# EAGLE schematic steering_wheel_V2 (EAGLE 6.3)

## Sheet 1 of 6
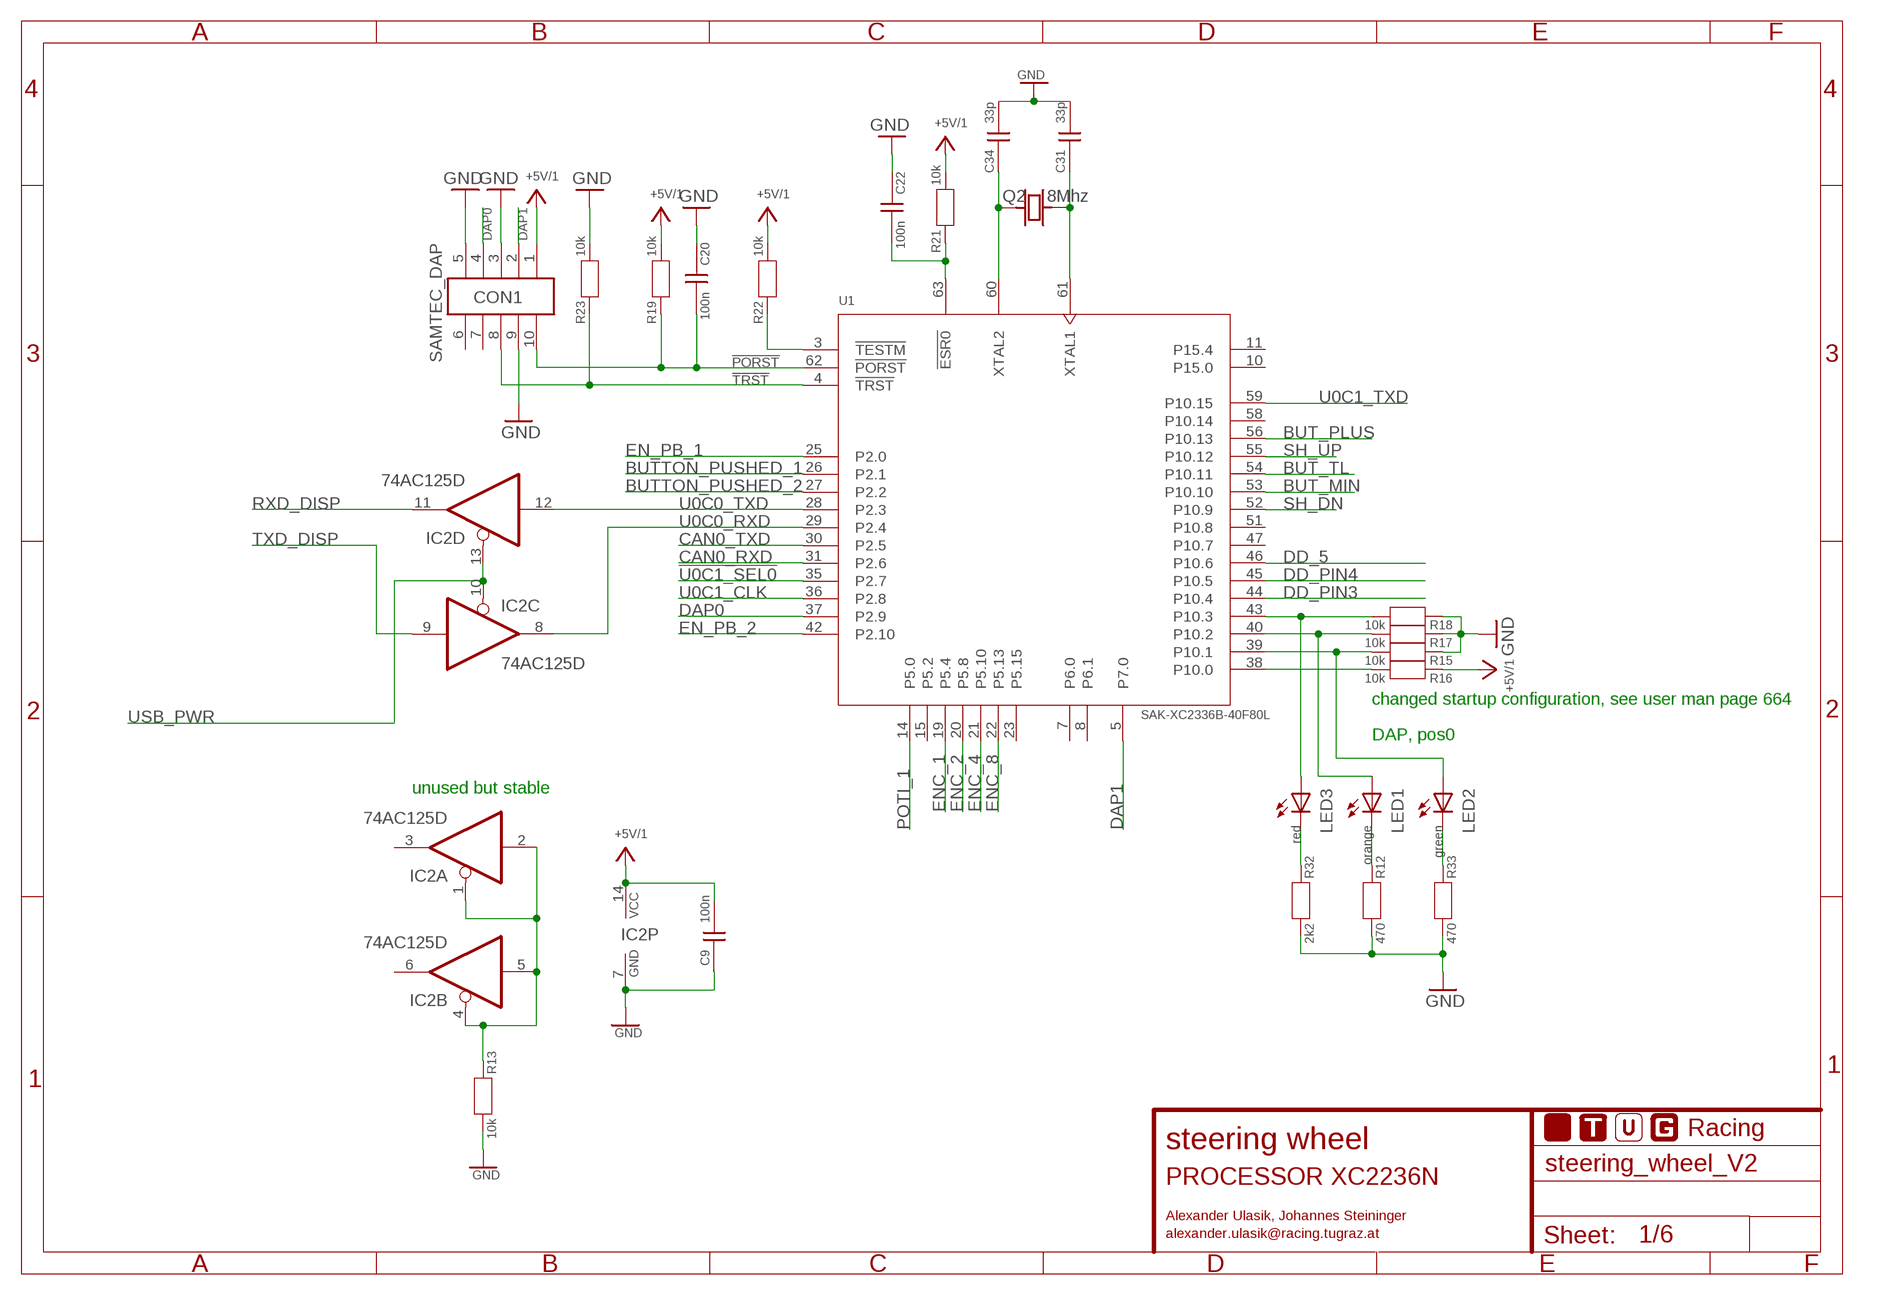
[diagram p0: schematic, sheet 1]

### Parts
C9  100n  C_1608M  [1608M_0603]
C20  100n  C_2012M  [2012M_0805]
C22  100n  C_2012M  [2012M_0805]
C31  33p  C_1608M  [1608M_0603]
C34  33p  C_1608M  [1608M_0603]
CON1  SAMTEC_DAP  [FTSH-105-01-XXX-DV-K]
FRAME1  A4L-LOC-RACING-NOLOGO  [NOLOGO]
IC2  74AC125D  [SO14]
LED1  LEDCHIPLED_0805  [CHIPLED_0805]
LED2  LEDCHIPLED_0805  [CHIPLED_0805]
LED3  LEDCHIPLED_0805  [CHIPLED_0805]
Q2  8Mhz  ABMM2  [ABMM2]
R12  470  R_2012M  [2012M_0805]
R13  10k  R_2012M  [2012M_0805]
R15  10k  R_2012M  [2012M_0805]
R16  10k  R_2012M  [2012M_0805]
R17  10k  R_2012M  [2012M_0805]
R18  10k  R_2012M  [2012M_0805]
R19  10k  R_2012M  [2012M_0805]
R21  10k  R_2012M  [2012M_0805]
R22  10k  R_2012M  [2012M_0805]
R23  10k  R_2012M  [2012M_0805]
R32  2k2  R_2012M  [2012M_0805]
R33  470  R_2012M  [2012M_0805]
U1  SAK-XC2336B-40F80L  [PG-LQFP-64-6]

### Nets
!PORST: C20.2 CON1.10 R19.1 U1.62(!PORST) ; also sheet 6
!TRST: CON1.8 R23.1 U1.4(!TRST) ; also sheet 6
!U0C1_SEL0: U1.35(P2.7) ; also sheet 4
+5V/1#: C9.2 CON1.1 IC2.14(P:VCC) R16.1 R19.2 R21.2 R22.2 ; supply symbol labelled +5V/1 ; also sheet 2,3,4,5,6
BUT_MIN: U1.53(P10.10) ; also sheet 6
BUT_PLUS: U1.56(P10.13) ; also sheet 6
BUT_TL: U1.54(P10.11) ; also sheet 6
BUTTON_PUSHED_1: U1.26(P2.1) ; also sheet 6
BUTTON_PUSHED_2: U1.27(P2.2) ; also sheet 6
CAN0_RXD: U1.31(P2.6) ; also sheet 5
CAN0_TXD: U1.30(P2.5) ; also sheet 5
DAP0: CON1.4 U1.37(P2.9) ; also sheet 6
DAP1: CON1.2 U1.5(P7.0) ; also sheet 6
DD_5: U1.46(P10.6) ; also sheet 6
DD_PIN3: U1.44(P10.4) ; also sheet 6
DD_PIN4: U1.45(P10.5) ; also sheet 6
EN_PB_1: U1.25(P2.0) ; also sheet 6
EN_PB_2: U1.42(P2.10) ; also sheet 6
ENC_1: U1.19(P5.4) ; also sheet 6
ENC_2: U1.20(P5.8) ; also sheet 6
ENC_4: U1.21(P5.10) ; also sheet 6
ENC_8: U1.22(P5.13) ; also sheet 6
GND: C9.1 C20.1 C22.1 C31.2 C34.2 CON1.3 CON1.5 CON1.9 IC2.7(P:GND) R12.2 R13.2 R15.1 R17.1 R18.1 R23.2 R32.2 R33.2 ; also sheet 2,3,4,5,6
N$1: C31.1 Q2.1 U1.61(XTAL1)
N$2: C34.1 Q2.3 U1.60(XTAL2)
N$4: R22.1 U1.3(!TESTM)
N$7: C22.2 R21.1 U1.63(!ESR0)
N$24: LED1.C R12.1
N$26: LED2.C R33.1
N$27: LED3.A R18.2 U1.43(P10.3)
N$28: IC2.1(A:OE) IC2.2(A:I) IC2.4(B:OE) IC2.5(B:I) R13.1
N$32: LED3.C R32.1
POTI_1: U1.14(P5.0) ; also sheet 6
RXD_DISP: IC2.11(D:O) ; also sheet 3,5
SH_DN: U1.52(P10.9) ; also sheet 6
SH_UP: U1.55(P10.12) ; also sheet 6
STATUS_0: R16.2 U1.38(P10.0)
STATUS_1: LED2.A R15.2 U1.39(P10.1)
STATUS_2: LED1.A R17.2 U1.40(P10.2)
TXD_DISP: IC2.9(C:I) ; also sheet 3,5
U0C0_RXD: IC2.8(C:O) U1.29(P2.4)
U0C0_TXD: IC2.12(D:I) U1.28(P2.3)
U0C1_CLK: U1.36(P2.8) ; also sheet 4
U0C1_TXD: U1.59(P10.15) ; also sheet 4
USB_PWR: IC2.10(C:OE) IC2.13(D:OE) ; also sheet 5
Unconnected: CON1.6 CON1.7 IC2.3(A:O) IC2.6(B:O) U1.7(P6.0) U1.8(P6.1) U1.10(P15.0) U1.11(P15.4) U1.15(P5.2) U1.23(P5.15) U1.47(P10.7) U1.51(P10.8) U1.58(P10.14)

### Notes on the sheet
- changed startup configuration, see user man page 664
- DAP, pos0
- unused but stable

## Sheet 2 of 6
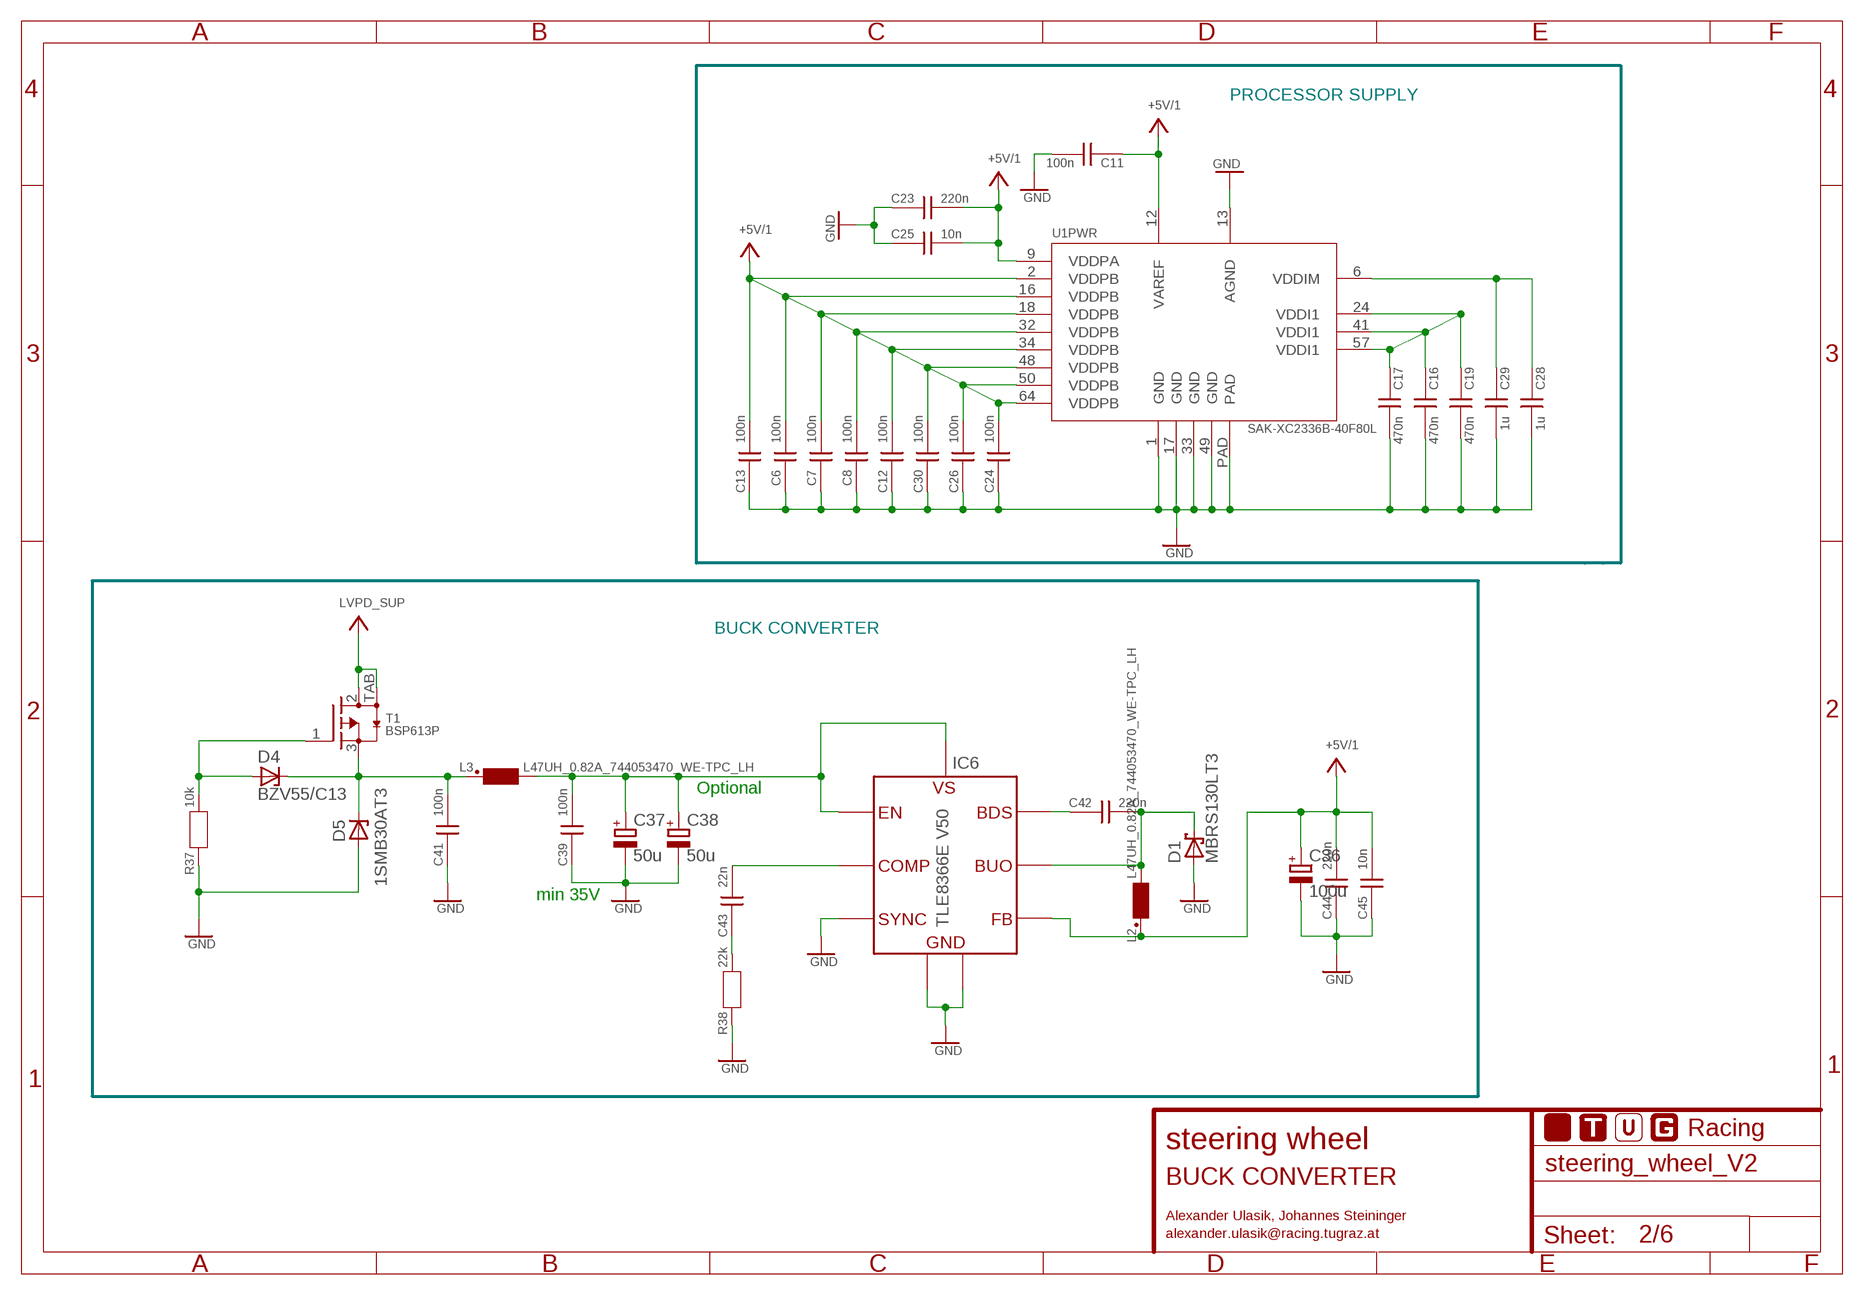
[diagram p1: schematic, sheet 2]

### Parts
C6  100n  C_2012M  [2012M_0805]
C7  100n  C_2012M  [2012M_0805]
C8  100n  C_2012M  [2012M_0805]
C11  100n  C_2012M  [2012M_0805]
C12  100n  C_2012M  [2012M_0805]
C13  100n  C_2012M  [2012M_0805]
C16  470n  C_2012M  [2012M_0805]
C17  470n  C_2012M  [2012M_0805]
C19  470n  C_2012M  [2012M_0805]
C23  220n  C_2012M  [2012M_0805]
C24  100n  C_2012M  [2012M_0805]
C25  10n  C_2012M  [2012M_0805]
C26  100n  C_2012M  [2012M_0805]
C28  1u  C_2012M  [2012M_0805]
C29  1u  C_2012M  [2012M_0805]
C30  100n  C_2012M  [2012M_0805]
C36  100u  CPOL-EUE5-10.5  [E5-10,5]
C37  50u  CPOL-EUE5-10.5  [E5-10,5]
C38  50u  CPOL-EUE5-10.5  [E5-10,5]
C39  100n  C_2012M  [2012M_0805]
C41  100n  C_2012M  [2012M_0805]
C42  220n  C_2012M  [2012M_0805]
C43  22n  C_2012M  [2012M_0805]
C44  220n  C_2012M  [2012M_0805]
C45  10n  C_2012M  [2012M_0805]
D1  MBRS130LT3  [SMB]
D4  BZV55/C13  ZENER-DIODESOD80C  [SOD80C]
D5  1SMB30AT3  ZENER-DIODESMB  [SMB]
FRAME4  A4L-LOC-RACING-BRD-TPLACE  [LOGO_RACING_BRD_TPLACE]
IC6  TLE8366E V50  TLE8366-II  [SOIC08-II]
L2  L47UH_0.82A_744053470_WE-TPC_LH  [WE-TPC_LH]
L3  L47UH_0.82A_744053470_WE-TPC_LH  [WE-TPC_LH]
R37  10k  R_2012M  [2012M_0805]
R38  22k  R_2012M  [2012M_0805]
T1  BSP613P  [SOT223-3]

### Nets
+5V/1#: C6.2 C7.2 C8.2 C11.1 C12.2 C13.2 C23.2 C24.2 C25.2 C26.2 C30.2 C36.+ C44.2 C45.2 IC6.4(FB) L2.1 U1.2(VDDPB) U1.9(VDDPA) U1.12(VAREF) U1.16(VDDPB) U1.18(VDDPB) U1.32(VDDPB) U1.34(VDDPB) U1.48(VDDPB) U1.50(VDDPB) U1.64(VDDPB) ; supply symbol labelled +5V/1 ; also sheet 1,3,4,5,6
GND: C6.1 C7.1 C8.1 C11.2 C12.1 C13.1 C16.2 C17.2 C19.2 C23.1 C24.1 C25.1 C26.1 C28.2 C29.2 C30.1 C36.- C37.- C38.- C39.1 C41.1 C44.1 C45.1 D1.A D5.A IC6.1(SYNC) IC6.2(GND1) IC6.HS(GND2) R37.1 R38.1 U1.1(GND) U1.13(AGND) U1.17(GND) U1.33(GND) U1.49(GND) U1.PAD ; also sheet 1,3,4,5,6
LVPD_SUP: T1.2(D) T1.TAB(D) ; also sheet 6
N$6: C16.1 C17.1 C19.1 U1.24(VDDI1) U1.41(VDDI1) U1.57(VDDI1)
N$9: C28.1 C29.1 U1.6(VDDIM)
N$23: C37.+ C38.+ C39.2 IC6.7(EN) IC6.8(VS) L3.2
N$30: C43.1 R38.2
N$34: D4.A R37.2 T1.1(G)
N$36: C43.2 IC6.3(COMP)
N$37: C42.2 D1.C IC6.6(BUO) L2.2
N$38: C42.1 IC6.5(BDS)
SUP6.1: C41.2 D4.C D5.C L3.1 T1.3(S)

### Notes on the sheet
- PROCESSOR SUPPLY
- BUCK CONVERTER
- Optional
- min 35V

## Sheet 3 of 6
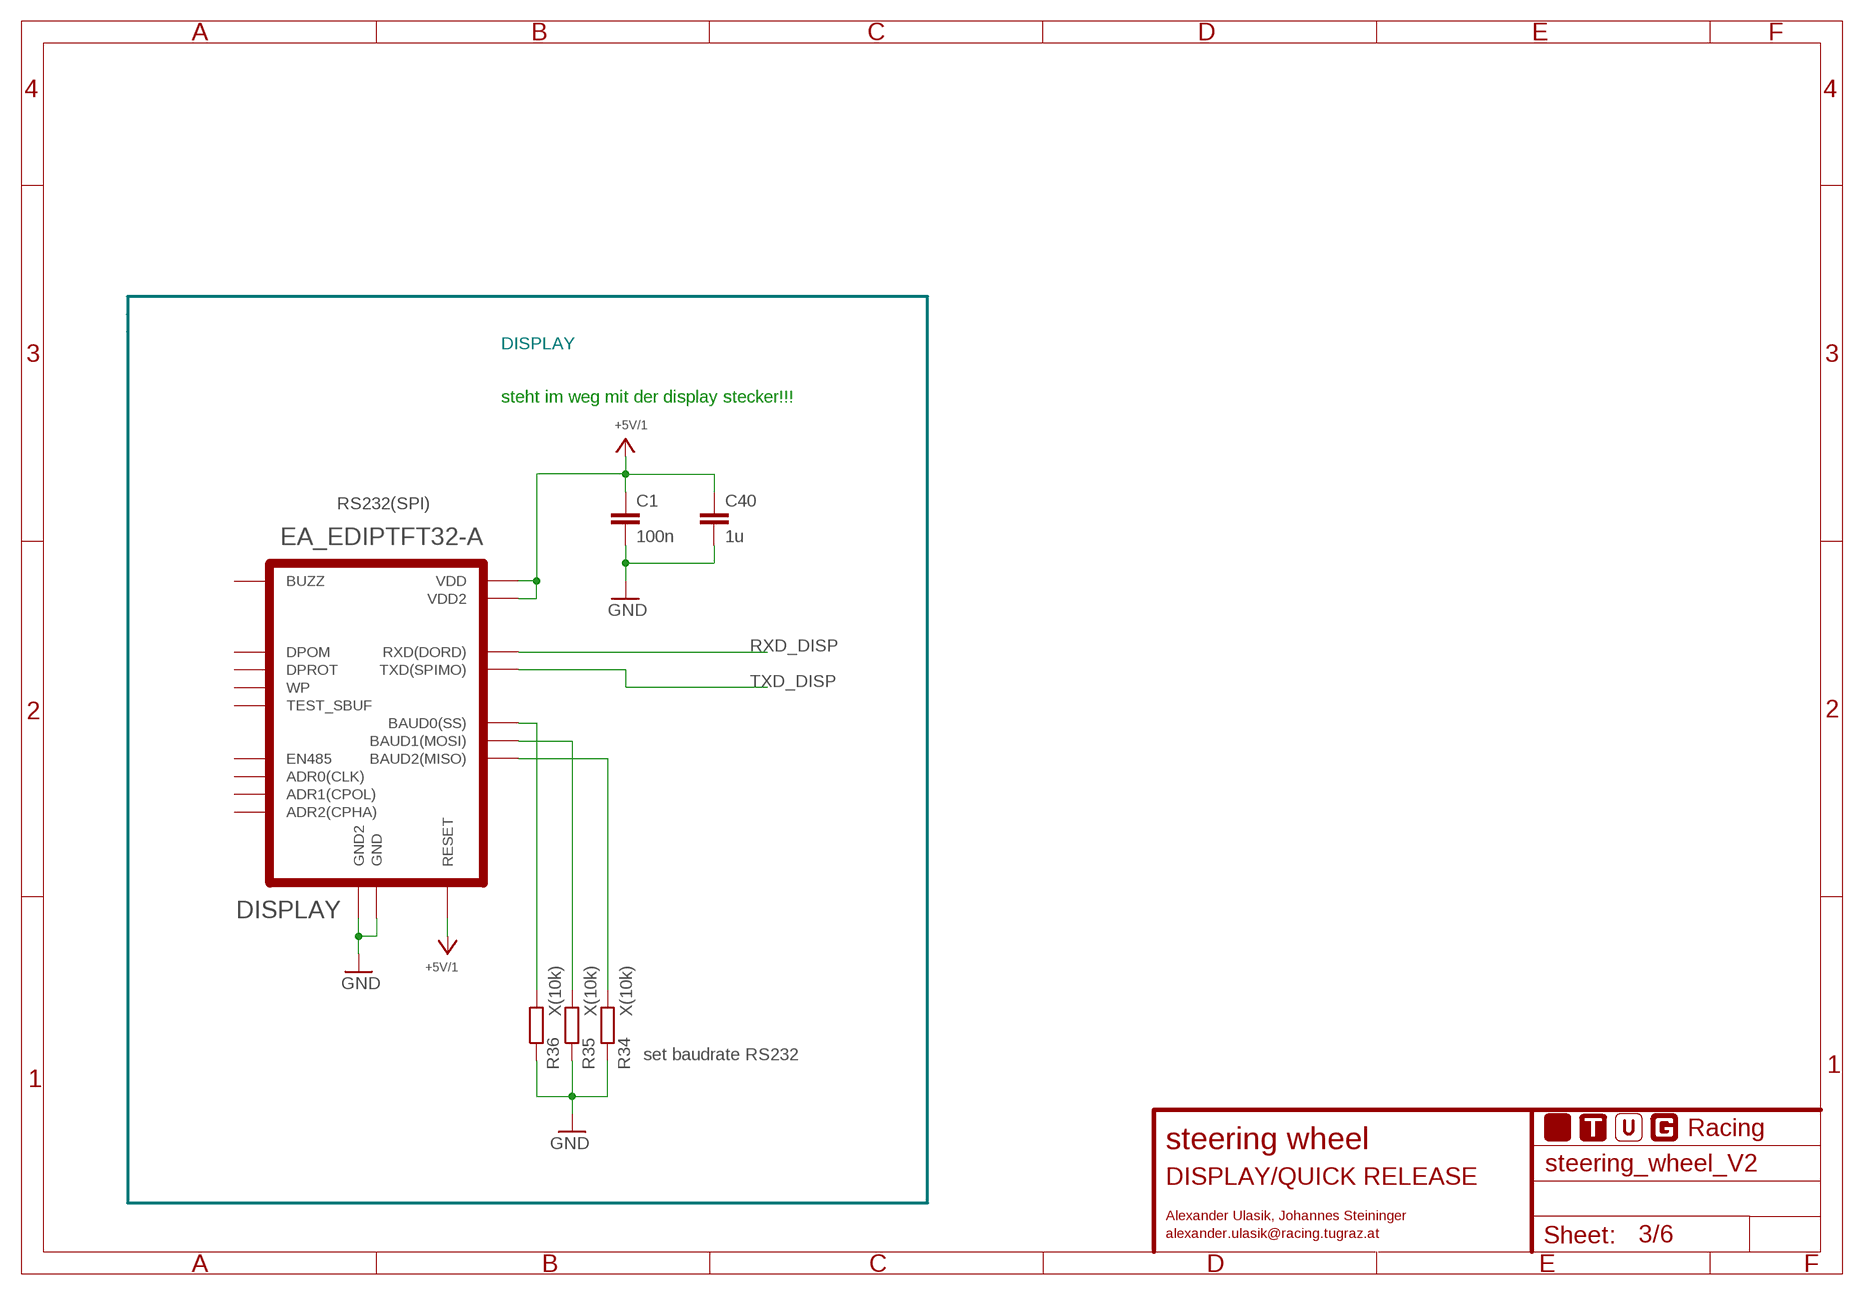
[diagram p2: schematic, sheet 3]

### Parts
C1  100n  C-EUC0805  [C0805]
C40  1u  C-EUC0805  [C0805]
DISPLAY  EA_EDIPTFT32-A  EA_EDIPTFT32-A-SR232  [EDIPTFT32-A]
FRAME3  A4L-LOC-RACING-NOLOGO  [NOLOGO]
R34  X(10k)  R-EU_R0805  [R0805]
R35  X(10k)  R-EU_R0805  [R0805]
R36  X(10k)  R-EU_R0805  [R0805]

### Nets
+5V/1#: C1.1 C40.1 DISPLAY.P$2(VDD) DISPLAY.P$5(RESET) DISPLAY.P$22(VDD2) ; supply symbol labelled +5V/1 ; also sheet 1,2,4,5,6
GND: C1.2 C40.2 DISPLAY.P$1(GND) DISPLAY.P$21(GND2) R34.1 R35.1 R36.1 ; also sheet 1,2,4,5,6
N$8: DISPLAY.P$8(BAUD2(MISO)) R34.2
N$10: DISPLAY.P$7(BAUD1(MOSI)) R35.2
N$13: DISPLAY.P$6(BAUD0(SS)) R36.2
RXD_DISP: DISPLAY.P$10(RXD(DORD)) ; also sheet 1,5
TXD_DISP: DISPLAY.P$11(TXD(SPIMO)) ; also sheet 1,5
Unconnected: DISPLAY.P$9(ADR0(CLK)) DISPLAY.P$12(EN485) DISPLAY.P$13(DPOM) DISPLAY.P$14(ADR1(CPOL)) DISPLAY.P$15(ADR2(CPHA)) DISPLAY.P$16(BUZZ) DISPLAY.P$17(DPROT) DISPLAY.P$19(WP) DISPLAY.P$20(TEST_SBUF)

### Notes on the sheet
- DISPLAY
- steht im weg mit der display stecker!!!
- set baudrate RS232

## Sheet 4 of 6
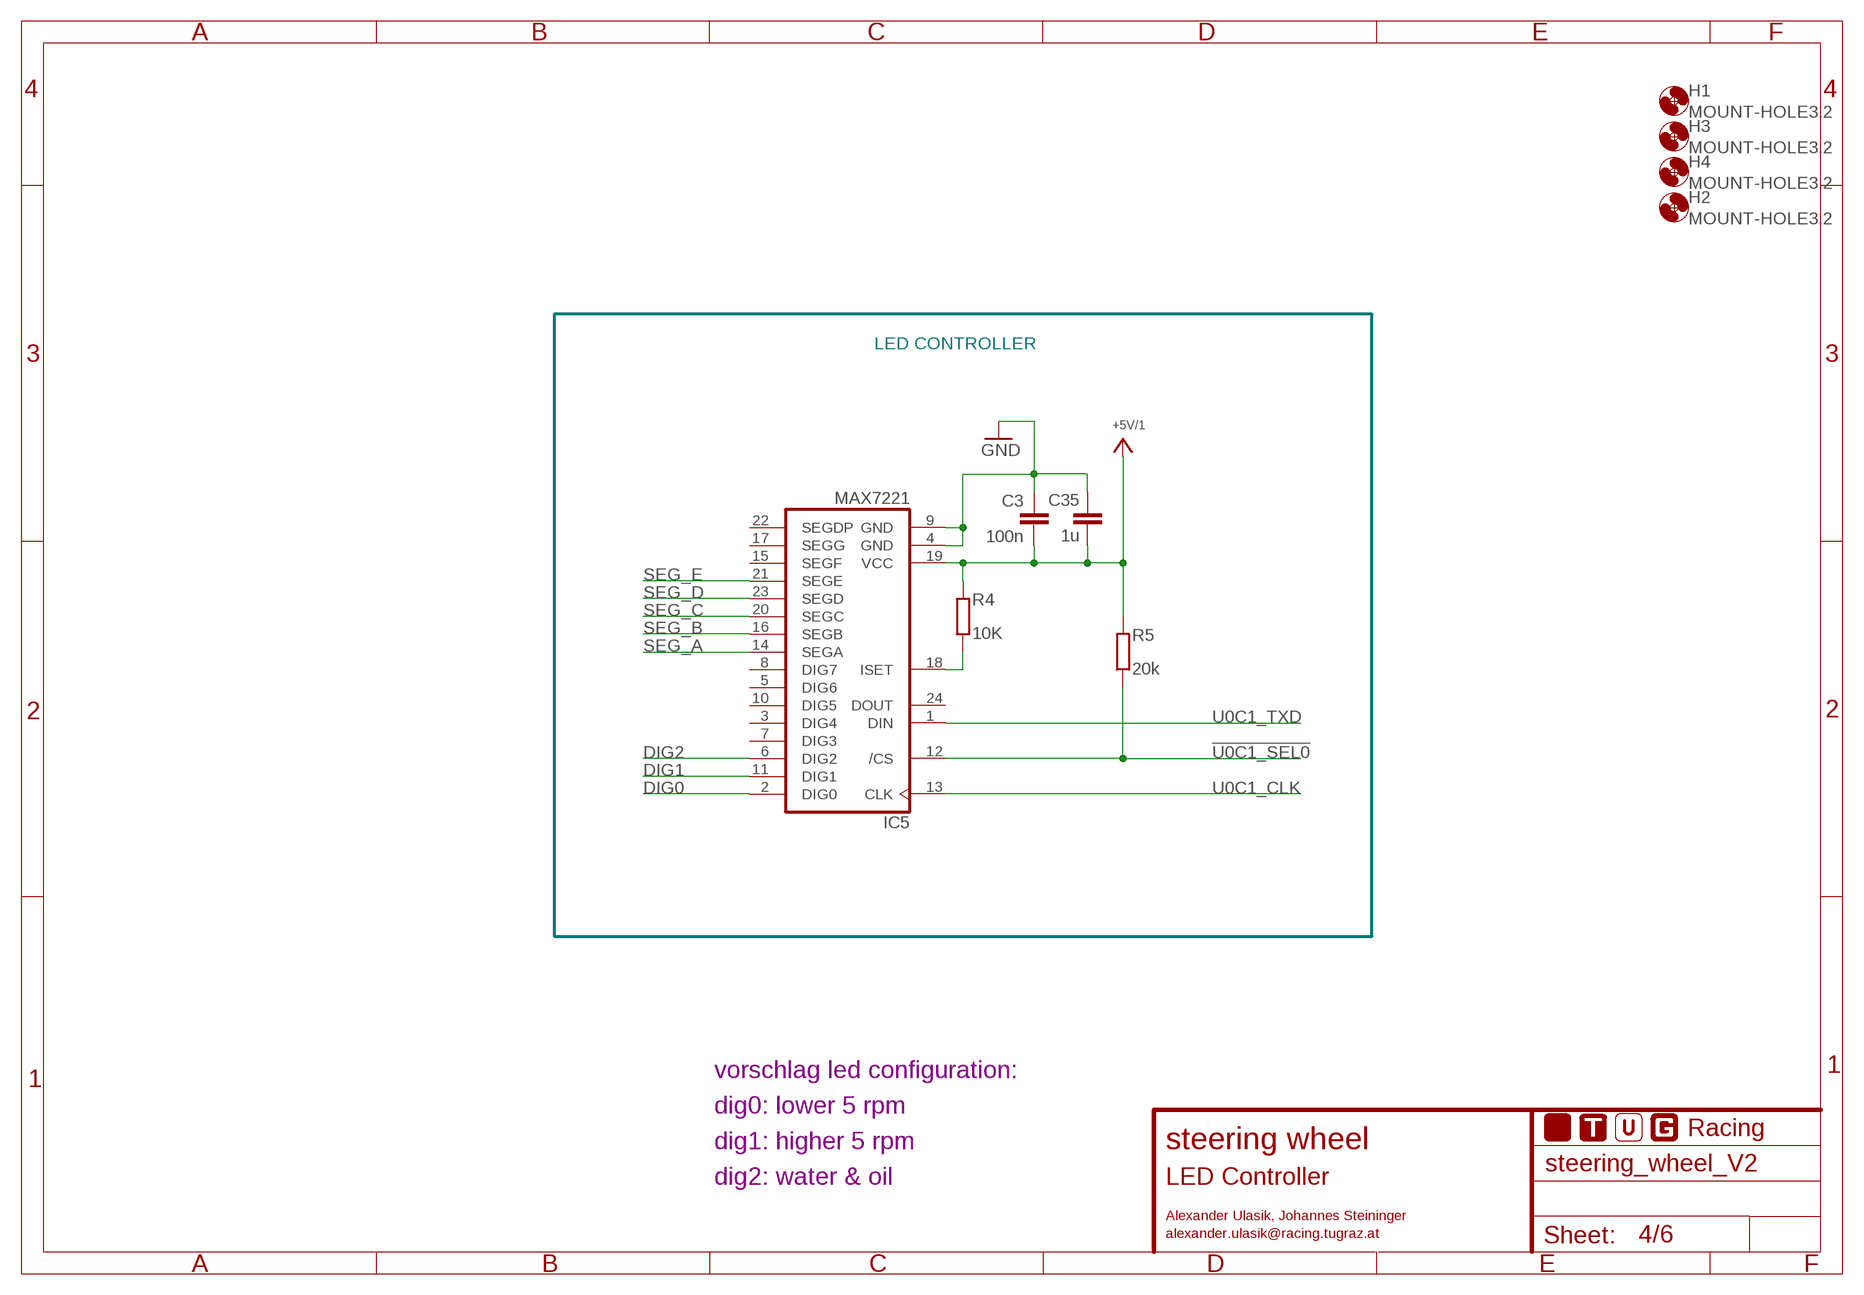
[diagram p3: schematic, sheet 4]

### Parts
C3  100n  C-EUC0805  [C0805]
C35  1u  C-EUC0805  [C0805]
FRAME5  A4L-LOC-RACING-NOLOGO  [NOLOGO]
H1  MOUNT-HOLE3.2  [3,2]
H2  MOUNT-HOLE3.2  [3,2]
H3  MOUNT-HOLE3.2  [3,2]
H4  MOUNT-HOLE3.2  [3,2]
IC5  MAX7221  [SO_W24]
R4  10K  R-EU_M0805  [M0805]
R5  20k  R-EU_M0805  [M0805]

### Nets
!U0C1_SEL0: IC5.12(/CS) R5.1 ; also sheet 1
+5V/1#: C3.1 C35.1 IC5.19(VCC) R4.1 R5.2 ; supply symbol labelled +5V/1 ; also sheet 1,2,3,5,6
DIG0: IC5.2(DIG0) ; also sheet 6
DIG1: IC5.11(DIG1) ; also sheet 6
DIG2: IC5.6(DIG2) ; also sheet 6
GND: C3.2 C35.2 IC5.4(GND) IC5.9(GND) ; also sheet 1,2,3,5,6
N$25: IC5.18(ISET) R4.2
SEG_A: IC5.14(SEGA) ; also sheet 6
SEG_B: IC5.16(SEGB) ; also sheet 6
SEG_C: IC5.20(SEGC) ; also sheet 6
SEG_D: IC5.23(SEGD) ; also sheet 6
SEG_E: IC5.21(SEGE) ; also sheet 6
U0C1_CLK: IC5.13(CLK) ; also sheet 1
U0C1_TXD: IC5.1(DIN) ; also sheet 1
Unconnected: IC5.3(DIG4) IC5.5(DIG6) IC5.7(DIG3) IC5.8(DIG7) IC5.10(DIG5) IC5.15(SEGF) IC5.17(SEGG) IC5.22(SEGDP) IC5.24(DOUT)

### Notes on the sheet
- LED CONTROLLER
- vorschlag led configuration:
- dig0: lower 5 rpm
- dig1: higher 5 rpm
- dig2: water & oil

## Sheet 5 of 6
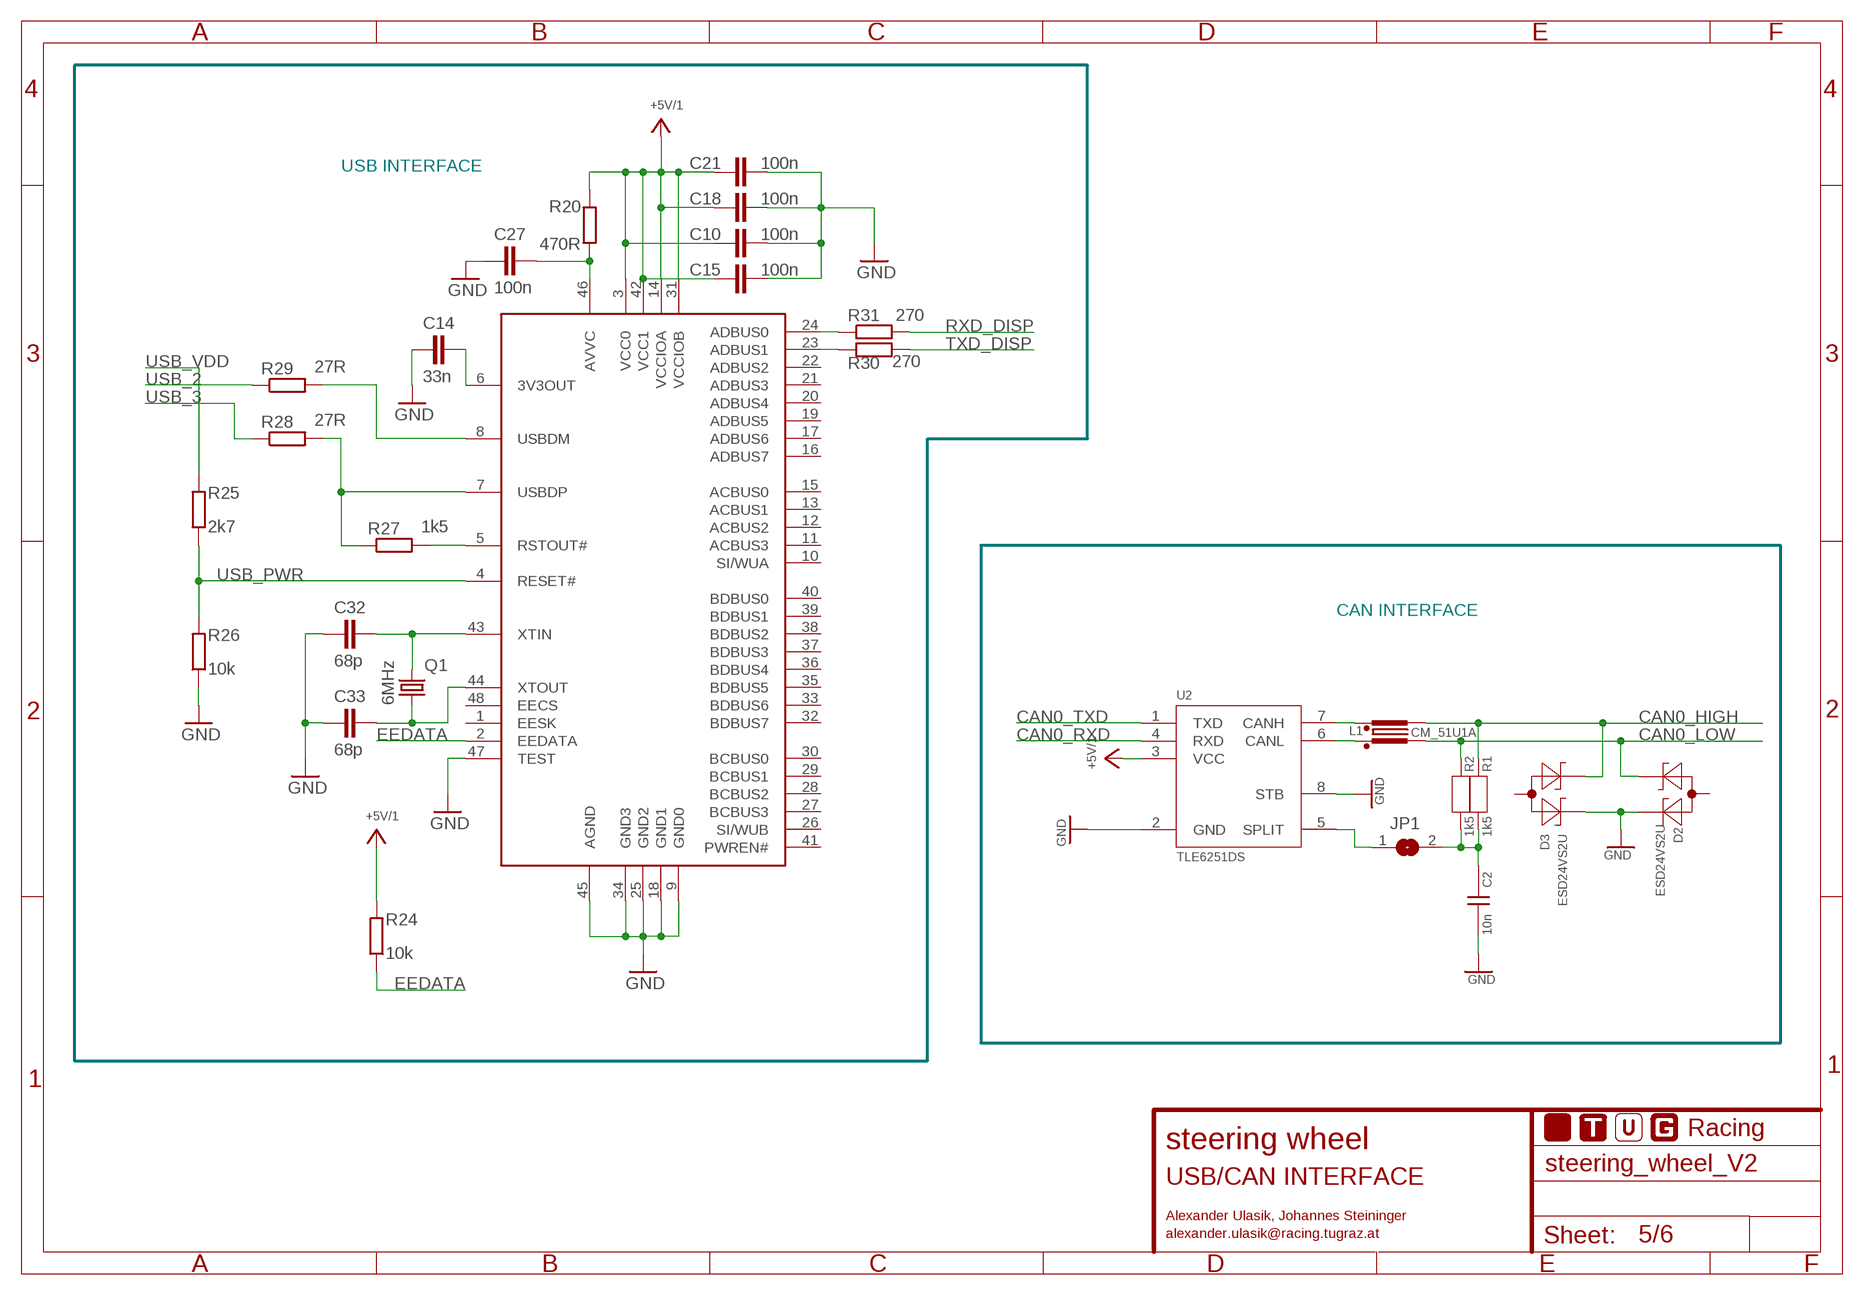
[diagram p4: schematic, sheet 5]

### Parts
C2  10n  C_2012M  [2012M_0805]
C10  100n  C-EUC0805  [C0805]
C14  33n  C-EUC0805  [C0805]
C15  100n  C-EUC0805  [C0805]
C18  100n  C-EUC0805  [C0805]
C21  100n  C-EUC0805  [C0805]
C27  100n  C-EUC0805  [C0805]
C32  68p  C-EUC0805  [C0805]
C33  68p  C-EUC0805  [C0805]
D2  ESD24VS2U  [SOT23-3]
D3  ESD24VS2U  [SOT23-3]
FRAME6  A4L-LOC-RACING-BRD-TPLACE  [LOGO_RACING_BRD_TPLACE]
IC1  FT2232  FT2232L  [LQFP48]
JP1  SJ  [SJ]
L1  CM_51U1A  [WE-SL2]
Q1  6MHz  CRYSTALHC49U70  [HC49U70]
R1  1k5  R_2012M  [2012M_0805]
R2  1k5  R_2012M  [2012M_0805]
R20  470R  R-EU_R0805  [R0805]
R24  10k  R-EU_R0805  [R0805]
R25  2k7  R-EU_R0805  [R0805]
R26  10k  R-EU_R0805  [R0805]
R27  1k5  R-EU_R0805  [R0805]
R28  27R  R-EU_R0805  [R0805]
R29  27R  R-EU_R0805  [R0805]
R30  270  R-EU_R0805  [R0805]
R31  270  R-EU_R0805  [R0805]
U2  TLE6251DS  [SO8]

### Nets
+5V/1#: C10.1 C15.1 C18.1 C21.1 IC1.3(VCC0) IC1.14(VCCIOA) IC1.31(VCCIOB) IC1.42(VCC1) R20.2 R24.2 U2.3(VCC) ; supply symbol labelled +5V/1 ; also sheet 1,2,3,4,6
CAN0_HIGH: D3.1(C1) L1.3 R1.1 ; also sheet 6
CAN0_LOW: D2.2(C2) L1.2 R2.1 ; also sheet 6
CAN0_RXD: U2.4(RXD) ; also sheet 1
CAN0_TXD: U2.1(TXD) ; also sheet 1
EEDATA: IC1.2(EEDATA) R24.1
GND: C2.2 C10.2 C14.1 C15.2 C18.2 C21.2 C27.1 C32.1 C33.1 D2.1(C1) D3.2(C2) IC1.9(GND0) IC1.18(GND1) IC1.25(GND2) IC1.34(GND3) IC1.45(AGND) IC1.47(TEST) R26.1 U2.2(GND) U2.8(STB) ; also sheet 1,2,3,4,6
N$3: C14.2 IC1.6(3V3OUT)
N$11: IC1.8(USBDM) R29.2
N$12: IC1.7(USBDP) R27.1 R28.2
N$14: IC1.5(RSTOUT#) R27.2
N$15: C27.2 IC1.46(AVVC) R20.1
N$16: L1.4 U2.7(CANH)
N$17: L1.1 U2.6(CANL)
N$18: IC1.24(ADBUS0) R31.1
N$19: IC1.23(ADBUS1) R30.1
N$20: C32.2 IC1.43(XTIN) Q1.2
N$21: C33.2 IC1.44(XTOUT) Q1.1
N$22: JP1.1 U2.5(SPLIT)
N$39: C2.1 JP1.2 R1.2 R2.2
RXD_DISP: R31.2 ; also sheet 1,3
TXD_DISP: R30.2 ; also sheet 1,3
USB_2: R29.1 ; also sheet 6
USB_3: R28.1 ; also sheet 6
USB_PWR: IC1.4(RESET#) R25.1 R26.2 ; also sheet 1
USB_VDD: R25.2 ; also sheet 6
Unconnected: D2.3(A) D3.3(A) IC1.1(EESK) IC1.10(SI/WUA) IC1.11(ACBUS3) IC1.12(ACBUS2) IC1.13(ACBUS1) IC1.15(ACBUS0) IC1.16(ADBUS7) IC1.17(ADBUS6) IC1.19(ADBUS5) IC1.20(ADBUS4) IC1.21(ADBUS3) IC1.22(ADBUS2) IC1.26(SI/WUB) IC1.27(BCBUS3) IC1.28(BCBUS2) IC1.29(BCBUS1) IC1.30(BCBUS0) IC1.32(BDBUS7) IC1.33(BDBUS6) IC1.35(BDBUS5) IC1.36(BDBUS4) IC1.37(BDBUS3) IC1.38(BDBUS2) IC1.39(BDBUS1) IC1.40(BDBUS0) IC1.41(PWREN#) IC1.48(EECS)

### Notes on the sheet
- USB INTERFACE
- CAN INTERFACE

## Sheet 6 of 6
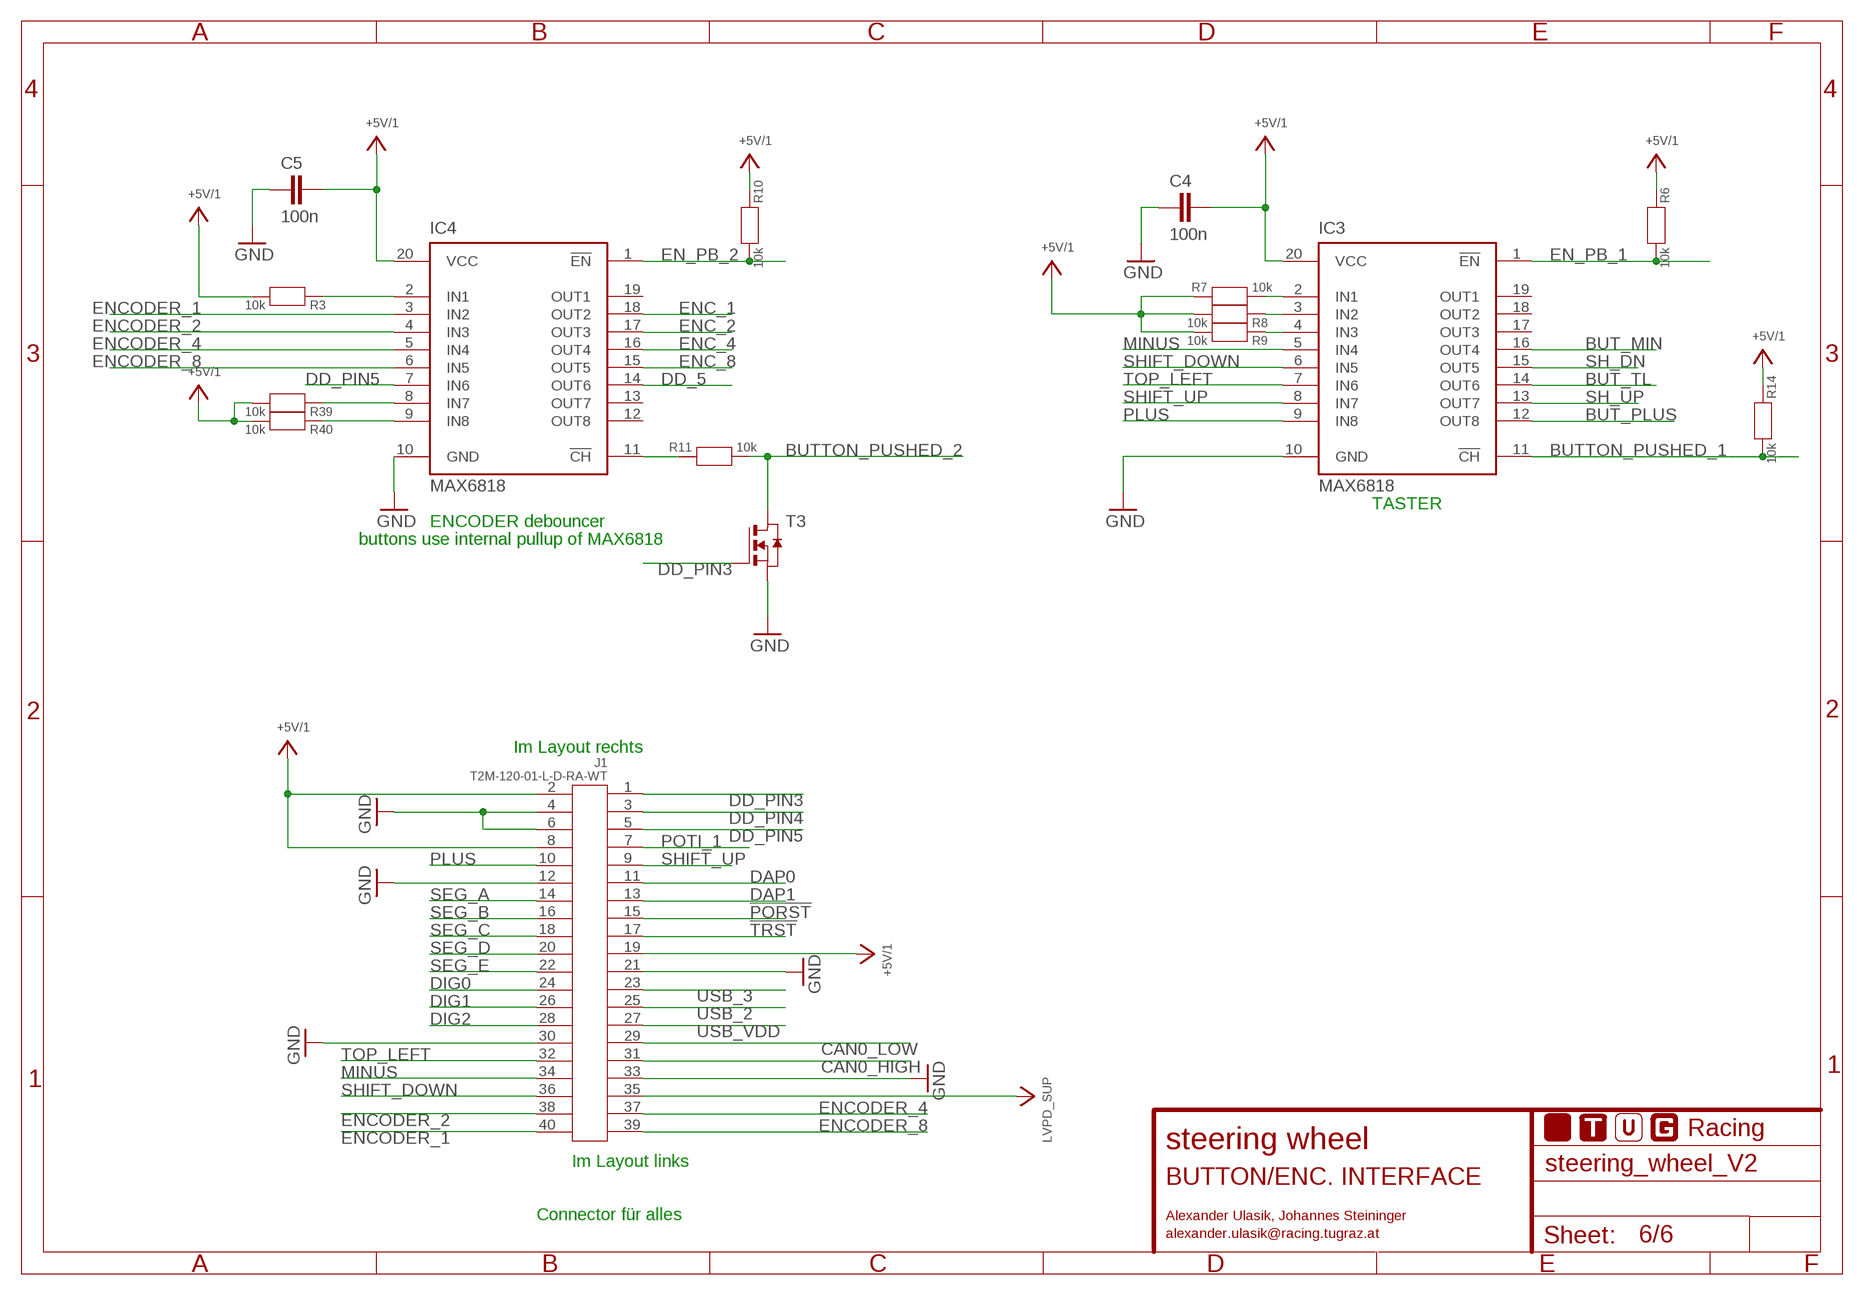
[diagram p5: schematic, sheet 6]

### Parts
C4  100n  C-EUC0805  [C0805]
C5  100n  C-EUC0805  [C0805]
FRAME2  A4L-LOC-RACING-NOLOGO  [NOLOGO]
IC3  MAX6818  [SSOP20]
IC4  MAX6818  [SSOP20]
J1  T2M-120-01-L-D-RA-WT  [T2M-120-01-L-D-RA-WT]
R3  10k  R_2012M  [2012M_0805]
R6  10k  R_2012M  [2012M_0805]
R7  10k  R_2012M  [2012M_0805]
R8  10k  R_2012M  [2012M_0805]
R9  10k  R_2012M  [2012M_0805]
R10  10k  R_2012M  [2012M_0805]
R11  10k  R_2012M  [2012M_0805]
R14  10k  R_2012M  [2012M_0805]
R39  10k  R_2012M  [2012M_0805]
R40  10k  R_2012M  [2012M_0805]
T3  NMOSSOT23  [SOT-23]

### Nets
!PORST: J1.15 ; also sheet 1
!TRST: J1.17 ; also sheet 1
+5V/1#: C4.2 C5.2 IC3.20(VCC) IC4.20(VCC) J1.2 J1.8 J1.19 R3.2 R6.1 R7.1 R8.2 R9.2 R10.1 R14.1 R39.2 R40.2 ; supply symbol labelled +5V/1 ; also sheet 1,2,3,4,5
BUT_MIN: IC3.16(OUT4) ; also sheet 1
BUT_PLUS: IC3.12(OUT8) ; also sheet 1
BUT_TL: IC3.14(OUT6) ; also sheet 1
BUTTON_PUSHED_1: IC3.11(!CH) R14.2 ; also sheet 1
BUTTON_PUSHED_2: R11.2 T3.1(D) ; also sheet 1
CAN0_HIGH: J1.31 ; also sheet 5
CAN0_LOW: J1.29 ; also sheet 5
DAP0: J1.11 ; also sheet 1
DAP1: J1.13 ; also sheet 1
DD_5: IC4.14(OUT6) ; also sheet 1
DD_PIN3: J1.1 T3.3(G) ; also sheet 1
DD_PIN4: J1.3 ; also sheet 1
DD_PIN5: IC4.7(IN6) J1.5
DIG0: J1.24 ; also sheet 4
DIG1: J1.26 ; also sheet 4
DIG2: J1.28 ; also sheet 4
EN_PB_1: IC3.1(!EN) R6.2 ; also sheet 1
EN_PB_2: IC4.1(!EN) R10.2 ; also sheet 1
ENC_1: IC4.18(OUT2) ; also sheet 1
ENC_2: IC4.17(OUT3) ; also sheet 1
ENC_4: IC4.16(OUT4) ; also sheet 1
ENC_8: IC4.15(OUT5) ; also sheet 1
ENCODER_1: IC4.3(IN2) J1.40
ENCODER_2: IC4.4(IN3) J1.38
ENCODER_4: IC4.5(IN4) J1.37
ENCODER_8: IC4.6(IN5) J1.39
GND: C4.1 C5.1 IC3.10(GND) IC4.10(GND) J1.4 J1.6 J1.12 J1.21 J1.30 J1.33 T3.2(S) ; also sheet 1,2,3,4,5
LVPD_SUP: J1.35 ; also sheet 2
MINUS: IC3.5(IN4) J1.34
N$5: IC4.8(IN7) R39.1
N$29: IC4.2(IN1) R3.1
N$31: IC4.9(IN8) R40.1
N$33: IC3.2(IN1) R7.2
N$35: IC4.11(!CH) R11.1
N$45: IC3.3(IN2) R8.1
N$46: IC3.4(IN3) R9.1
PLUS: IC3.9(IN8) J1.10
POTI_1: J1.7 ; also sheet 1
SEG_A: J1.14 ; also sheet 4
SEG_B: J1.16 ; also sheet 4
SEG_C: J1.18 ; also sheet 4
SEG_D: J1.20 ; also sheet 4
SEG_E: J1.22 ; also sheet 4
SH_DN: IC3.15(OUT5) ; also sheet 1
SH_UP: IC3.13(OUT7) ; also sheet 1
SHIFT_DOWN: IC3.6(IN5) J1.36
SHIFT_UP: IC3.8(IN7) J1.9
TOP_LEFT: IC3.7(IN6) J1.32
USB_2: J1.25 ; also sheet 5
USB_3: J1.23 ; also sheet 5
USB_VDD: J1.27 ; also sheet 5
Unconnected: IC3.17(OUT3) IC3.18(OUT2) IC3.19(OUT1) IC4.12(OUT8) IC4.13(OUT7) IC4.19(OUT1)

### Notes on the sheet
- TASTER
- ENCODER debouncer
- buttons use internal pullup of MAX6818
- Im Layout rechts
- Im Layout links
- Connector für alles

## Library data of the parts
C1 C3-C5 C10 C14 C15 C18 C21 C27 C32 C33 C35 C40 = rcl:C-EU: CAPACITOR, European symbol
C2 C6-C9 C11-C13 C16 C17 C19 C20 C22-C26 C28-C31 C34 C39 C41-C45 = C:C
C36-C38 = rcl:CPOL-EU: POLARIZED CAPACITOR, European symbol
CON1 = Samtec_E_Racing:SAMTEC_DAP
D1 = diode:MBRS130LT3: Schottky Power Rectifier Source: http://www.onsemi.com/pub/Collateral/MBRS130LT3-D.PDF
D2 D3 = D:ESD24VS2U: Silicon TVS diodes ESD24VS2U Features: ESD / transient protection of automotive CAN / LIN bus networks / transceivers, industrial bus systems and power supply lines according to: IEC61000-4-2 (ESD): ± 30 kV (air / contact) IEC61000-4-4 (EFT): 80 A (5/50 ns) IEC61000-4-5 (surge): 5 A (8/20 µs) ISO7637-2: Pulse 1 (max. 50 V), Pulse 2 (max. 125 V), Pulse 3a, b (max. 800 V) Max. working voltage: 24 V Low capacitance: 24 pF typ. Low clamping voltage: < 41 V Extremely low reverse current: < 1 nA typ. Pb-free (RoHS compliant) package Qualified according AEC Q101 Applications: Low and High-Speed CAN Fault Tolerant CAN Industrial control networks 12/24 V DC power supply lines
D4 = diode:ZENER-DIODE: Z-Diode
D5 = 1Adiode:ZENER-DIODE: Z-Diode
DISPLAY = _TUG Racing Team_:EA_EDIPTFT32-A-SR232
FRAME1 = frames:A4L-LOC-RACING: FRAME DIN A4, landscape with location and doc. field; FRAME_EMAIL: alexander.ulasik@racing.tugraz.at; FRAME_SUBTITLE: PROCESSOR XC2236N; FRAME_TITLE: steering wheel; FRAME_USER: Alexander Ulasik, Johannes Steininger
FRAME2 = frames:A4L-LOC-RACING: FRAME DIN A4, landscape with location and doc. field; FRAME_EMAIL: alexander.ulasik@racing.tugraz.at; FRAME_SUBTITLE: BUTTON/ENC. INTERFACE; FRAME_TITLE: steering wheel; FRAME_USER: Alexander Ulasik, Johannes Steininger
FRAME3 = frames:A4L-LOC-RACING: FRAME DIN A4, landscape with location and doc. field; FRAME_EMAIL: alexander.ulasik@racing.tugraz.at; FRAME_SUBTITLE: DISPLAY/QUICK RELEASE; FRAME_SUBTITLE_SUB: QUICK RELEASE; FRAME_TITLE: steering wheel; FRAME_USER: Alexander Ulasik, Johannes Steininger
FRAME4 = frames:A4L-LOC-RACING: FRAME DIN A4, landscape with location and doc. field; FRAME_EMAIL: alexander.ulasik@racing.tugraz.at; FRAME_SUBTITLE: BUCK CONVERTER; FRAME_TITLE: steering wheel; FRAME_USER: Alexander Ulasik, Johannes Steininger
FRAME5 = frames:A4L-LOC-RACING: FRAME DIN A4, landscape with location and doc. field; FRAME_EMAIL: alexander.ulasik@racing.tugraz.at; FRAME_SUBTITLE: LED Controller; FRAME_SUBTITLE_SUB: LED Controller; FRAME_TITLE: steering wheel; FRAME_USER: Alexander Ulasik, Johannes Steininger
FRAME6 = frames:A4L-LOC-RACING: FRAME DIN A4, landscape with location and doc. field; FRAME_EMAIL: alexander.ulasik@racing.tugraz.at; FRAME_SUBTITLE: USB/CAN INTERFACE; FRAME_TITLE: steering wheel; FRAME_USER: Alexander Ulasik, Johannes Steininger
H1-H4 = holes:MOUNT-HOLE: MOUNTING HOLE with drill center marker
IC1 = ftdichip:FT2232L: USB UART / FIFO Controller 3nd Generation USB Double-UART (USB <-> Serial) - FIFO Controller
IC2 = 74xx-eu:74*125: Quad bus BUFFER, 3-state
IC3 IC4 = misto:MAX6818: +-15kV ESD-Protected, Octal CMOS Switch Debouncers
IC5 = _TUG Racing Team_:MAX7221
IC6 = infineon:TLE8366
J1 = J:T2M-120-01-L-D-*: Samtec Tiger Eye 2mm Wire-to-Board Sockets Specifications Wire: 24, 26, 28 or 30 AWG Current Rating: 3.0A per pin
JP1 = jumper:SJ: SMD solder JUMPER
L1 = L:CM: Common Mode Line Filter Type Case L @ 1kHz [H] Z [Ohm] Inom [mA] Rdc [Ohm] Application Würth No. CM_67R400MA 0805 67 @ 100MHz 400 0.25 744231061 CM_90R370MA 0805 90 @ 100MHz 370 0.30 USB 2.0 744231091 CM_120R370MA 0805 120 @ 100MHz 370 0.30 IEEE1394/Firewire 400 Mbps 744231121 CM_180R330MA 0805 180 @ 100MHz 330 0.35 IEEE1394/Firewire 400 Mbps 744231181 CM_260R300MA 0805 260 @ 100MHz 300 0.40 744231261 CM_370R280MA 0805 370 @ 100MHz 280 0.45 IEEE1394/Firewire 400 Mbps 744231371 CM_51U1A WS-SL2 51µ max. 5000 1000 0.16 CAN 744227S
L2 L3 = L:L: Inductance SMD Inductances Power-Chokes: Wuerth Elektronik WE-PD Series Wuerth Elektronik WE-TPC Series Coiltronics DR Series Distributor: Farnell Austria - http://at.farnell.com/
LED1-LED3 = led:LED: LED OSRAM: - CHIPLED LG R971, LG N971, LY N971, LG Q971, LY Q971, LO R971, LY R971 LH N974, LH R974 LS Q976, LO Q976, LY Q976 LO Q996 - Hyper CHIPLED LW Q18S LB Q993, LB Q99A, LB R99A - SideLED LS A670, LO A670, LY A670, LG A670, LP A670 LB A673, LV A673, LT A673, LW A673 LH A674 LY A675 LS A676, LA A676, LO A676, LY A676, LW A676 LS A679, LY A679, LG A679 - Hyper Micro SIDELED® LS Y876, LA Y876, LO Y876, LY Y876 LT Y87S - SmartLED LW L88C, LW L88S LB L89C, LB L89S, LG L890 LS L89K, LO L89K, LY L89K LS L896, LA L896, LO L896, LY L896 - TOPLED LS T670, LO T670, LY T670, LG T670, LP T670 LSG T670, LSP T670, LSY T670, LOP T670, LYG T670 LG T671, LOG T671, LSG T671 LB T673, LV T673, LT T673, LW T673 LH T674 LS T676, LA T676, LO T676, LY T676, LB T676, LH T676, LSB T676, LW T676 LB T67C, LV T67C, LT T67C, LS T67K, LO T67K, LY T67K, LW E67C LS E67B, LA E67B, LO E67B, LY E67B, LB E67C, LV E67C, LT E67C LW T67C LS T679, LY T679, LG T679 LS T770, LO T770, LY T770, LG T770, LP T770 LB T773, LV T773, LT T773, LW T773 LH T774 LS E675, LA E675, LY E675, LS T675 LS T776, LA T776, LO T776, LY T776, LB T776 LHGB T686 LT T68C, LB T68C - Hyper Mini TOPLED® LB M676 - Mini TOPLED Santana® LG M470 LS M47K, LO M47K, LY M47K Source: http://www.osram.convergy.de LUXEON: - LUMILED® LXK2-PW12-R00, LXK2-PW12-S00, LXK2-PW14-U00, LXK2-PW14-V00 LXK2-PM12-R00, LXK2-PM12-S00, LXK2-PM14-U00 LXK2-PE12-Q00, LXK2-PE12-R00, LXK2-PE12-S00, LXK2-PE14-T00, LXK2-PE14-U00 LXK2-PB12-K00, LXK2-PB12-L00, LXK2-PB12-M00, LXK2-PB14-N00, LXK2-PB14-P00, LXK2-PB14-Q00 LXK2-PR12-L00, LXK2-PR12-M00, LXK2-PR14-Q00, LXK2-PR14-R00 LXK2-PD12-Q00, LXK2-PD12-R00, LXK2-PD12-S00 LXK2-PH12-R00, LXK2-PH12-S00 LXK2-PL12-P00, LXK2-PL12-Q00, LXK2-PL12-R00 Source: www.luxeon.com KINGBRIGHT: KA-3528ASYC Source: www.kingbright.com; ASMT-RA45-AQ502: amber; ASMT-RF45-AQ502: green; ASMT-RJ45-AQ502: orange; ASMT-RR45-AQ502: red
Q1 = crystal:CRYSTAL: CRYSTAL
Q2 = oszillator:ABMM2
R1-R3 R6-R19 R21-R23 R32 R33 R37-R40 = R:R
R4 R5 R20 R24-R31 R34-R36 = rcl:R-EU_: RESISTOR, European symbol
T1 = T:BSP613P: SIPMOS® BSP613P P-channel Small-Signal-Transistor MOSFET 60V, 2.9A, RDSon 0.13 Ohm Features: P-Channel Enhancement mode Avalanche rated dv/dt rated Ideal for fast switching buck converter
T3 = zetex:NMOSSOT23: MOS FET; OC_FARNELL: unknown; OC_NEWARK: unknown
U1 = U:SAK-XC2336B-*: 16-Bit Microcontroller XC2336B The XC236xB (LQFP-100) and XC2336B (LQFP-64) microcontroller series is based on Infineon's popular and well-established C166 architecture. With a Flash size of up to 320 K and a 80MHz performance, the micro controller is well suited for automotive safety applications. Key features: Up to 80 MHz frequency = 80 MIPS performance Up to 320 KB of flash memory and 34 KB of RAM Parallel Flash Programming Up to 2 PWM units (CCU6) to drive 3-phase motor 2 very fast 10-bit A/D converters Up to 6 serial interfaces (USIC channels) Up to 3 CAN / 64MO Low active power consumption DAP - Device Access Port (2 wire JTAG, replaces 5 wire JTAG) see http://www.infineon.com/xc2300
U2 = U:TLE6251DS: High Speed CAN-Transceiver with Bus wake-up TLE6251DS Features: CAN data transmission rate up to 1 Mbaud Compatible to ISO/DIS 11898 Supports 12 V and 24 V automotive applications Low power mode with remote wake-up via CAN bus Wake signaling by RxD change No BUS load in stand-by mode Wide common mode range for electromagnetic immunity (EMI) Digital inputs compatible to 3.3 and 5 V logic devices CAN short circuit proof to ground, battery and VCC Split termination to stabilize the recessive level TxD time-out function Overtemperature protection Protected against automotive transients Green Product (RoHS compliant) AEC Qualified